# Altium project PA_PShifter_R00.PrjPcb
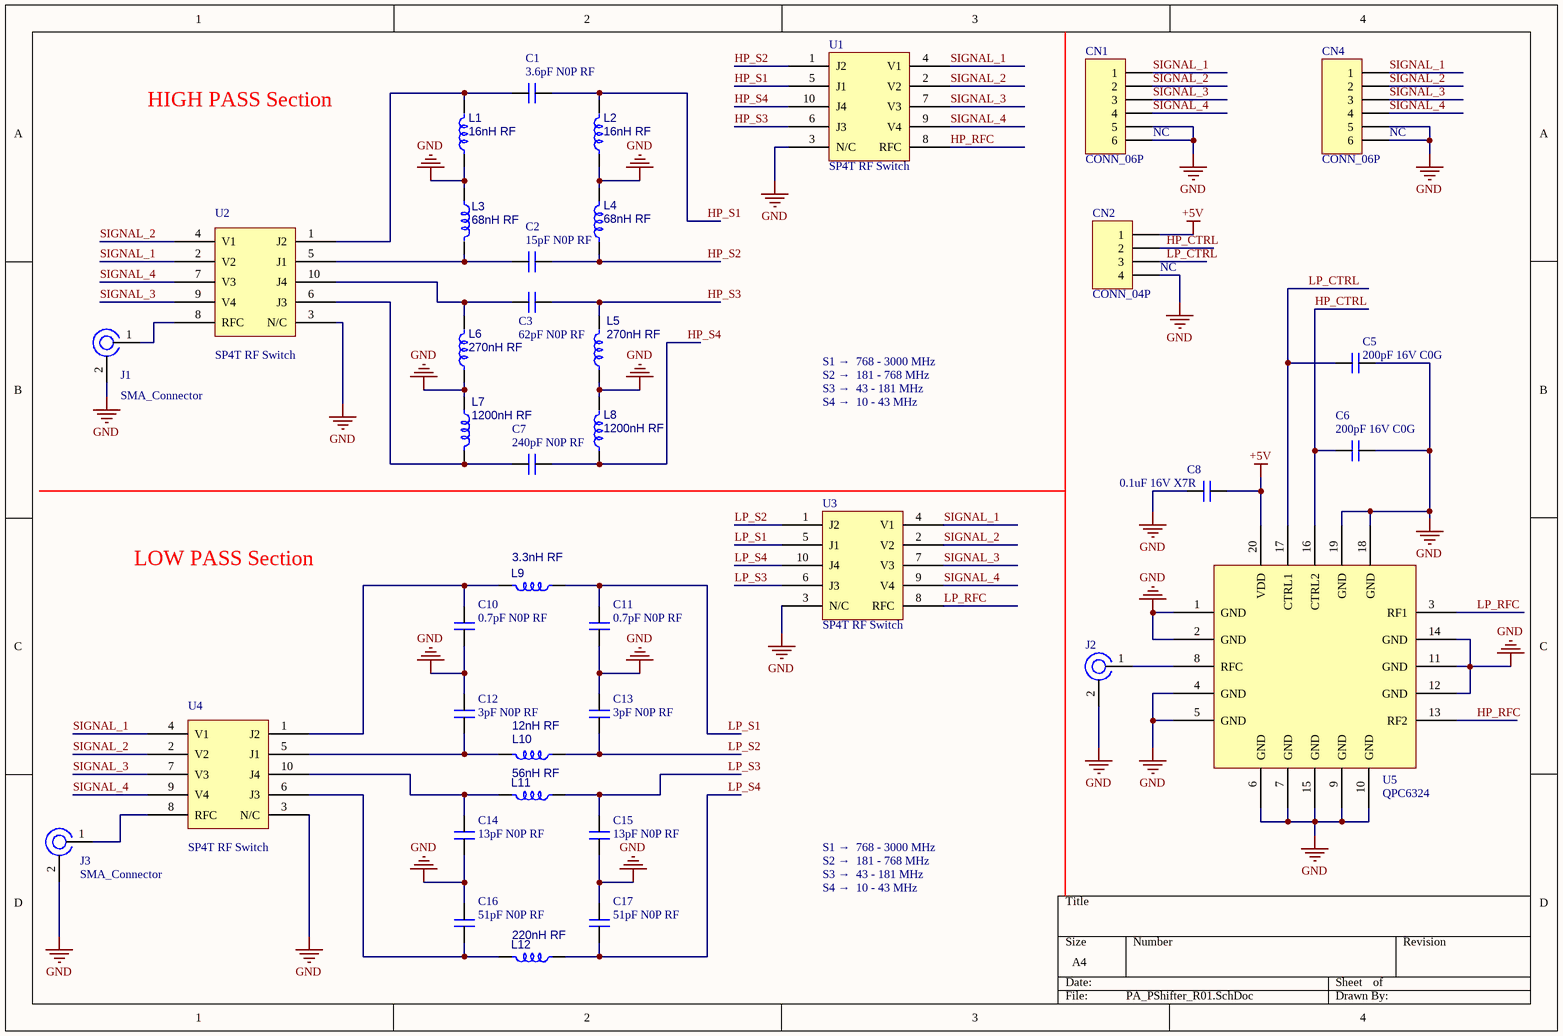
[diagram p0: PA_PShifter_R01.SchDoc]
1 sheet, 38 parts. Net scope: global (net labels, ports and power ports of the same name join across sheets).
Board file: PA_PShifter_R00.PcbDoc

## Sheet PA_PShifter_R01.SchDoc
size A4; SheetNumber: 1; SheetTotal: 1

### Parts
C1  3.6pF N0P RF  [C_0603]
C2  15pF N0P RF  [C_0603]
C3  62pF N0P RF  [C_0603]
C5  200pF 16V C0G  [C_0603]
C6  200pF 16V C0G  [C_0603]
C7  240pF N0P RF  [C_0603]
C8  0.1uF 16V X7R  [C_0603]
C10  0.7pF N0P RF  [C_0603]
C11  0.7pF N0P RF  [C_0603]
C12  3pF N0P RF  [C_0603]
C13  3pF N0P RF  [C_0603]
C14  13pF N0P RF  [C_0603]
C15  13pF N0P RF  [C_0603]
C16  51pF N0P RF  [C_0603]
C17  51pF N0P RF  [C_0603]
CN1  CONN_06P  [Header_M_2x3_0.1"]
CN2  CONN_04P  [Header_M_2x2_0.1"]
CN4  CONN_06P  [Header_M_2x3_0.1"]
J1  SMA_Connector  [SMA_Connector]
J2  SMA_Connector  [SMA_Connector]  (value not drawn)
J3  SMA_Connector  [SMA_Connector]
L1  16nH RF  [L_0603]
L2  16nH RF  [L_0603]
L3  68nH RF  [L_0603]
L4  68nH RF  [L_0603]
L5  270nH RF  [L_0603]
L6  270nH RF  [L_0603]
L7  1200nH RF  [L_0805]
L8  1200nH RF  [L_0805]
L9  3.3nH RF  [L_0603]
L10  12nH RF  [L_0603]
L11  56nH RF  [L_0603]
L12  220nH RF  [L_0603]
U1  SP4T RF Switch  [SP4T Switch RF]
U2  SP4T RF Switch  [SP4T Switch RF]
U3  SP4T RF Switch  [SP4T Switch RF]
U4  SP4T RF Switch  [SP4T Switch RF]
U5  QPC6324  [QFN50P400X400X90-21N-D]

### Nets
+5V: C8.2 CN2.1 U5.20(VDD)
GND: C5.2 C6.2 C8.1 C10.1 C11.1 C12.2 C13.2 C14.1 C15.1 C16.2 C17.2 CN1.5 CN1.6 CN2.4 CN4.5 CN4.6 J1.2 J2.2 J3.2 L1.1 L2.1 L3.1 L4.2 L5.1 L6.1 L7.1 L8.2 U1.3(N/C) U2.3(N/C) U3.3(N/C) U4.3(N/C) U5.1(GND) U5.2(GND) U5.4(GND) U5.5(GND) U5.6(GND) U5.7(GND) U5.9(GND) U5.10(GND) U5.11(GND) U5.12(GND) U5.14(GND) U5.15(GND) U5.18(GND) U5.19(GND)
HP_CTRL: C6.1 CN2.2 U5.16(CTRL2)
HP_RFC: U1.8(RFC) U5.13(RF2)
HP_S1: C1.2 L2.2 U1.5(J1)
HP_S2: C2.2 L4.1 U1.1(J2)
HP_S3: C3.2 L5.2 U1.6(J3)
HP_S4: C7.2 L8.1 U1.10(J4)
LP_CTRL: C5.1 CN2.3 U5.17(CTRL1)
LP_RFC: U3.8(RFC) U5.3(RF1)
LP_S1: C11.2 L9.1 U3.5(J1)
LP_S2: C13.1 L10.1 U3.1(J2)
LP_S3: C15.2 L11.1 U3.6(J3)
LP_S4: C17.1 L12.1 U3.10(J4)
SIGNAL_1: CN1.1 CN4.1 U1.4(V1) U2.2(V2) U3.4(V1) U4.4(V1)
SIGNAL_2: CN1.2 CN4.2 U1.2(V2) U2.4(V1) U3.2(V2) U4.2(V2)
SIGNAL_3: CN1.3 CN4.3 U1.7(V3) U2.9(V4) U3.7(V3) U4.7(V3)
SIGNAL_4: CN1.4 CN4.4 U1.9(V4) U2.7(V3) U3.9(V4) U4.9(V4)
NetC1_1: C1.1 L1.2 U2.1(J2)
NetC2_1: C2.1 L3.2 U2.5(J1)
NetC3_1: C3.1 L6.2 U2.10(J4)
NetC7_1: C7.1 L7.2 U2.6(J3)
NetC10_2: C10.2 L9.2 U4.1(J2)
NetC12_1: C12.1 L10.2 U4.5(J1)
NetC14_2: C14.2 L11.2 U4.10(J4)
NetC16_1: C16.1 L12.2 U4.6(J3)
NetJ1_1: J1.1 U2.8(RFC)
NetJ2_1: J2.1 U5.8(RFC)
NetJ3_1: J3.1 U4.8(RFC)

### Notes on the sheet
- HIGH PASS Section
- (near CN1) NC
- (near CN4) NC
- (near CN2) NC
- S1 →
- S2 →
- 181 - 768 MHz
- 768 - 3000 MHz
- S3 →
- S4 →
- 43 - 181 MHz
- 10 - 43 MHz
- LOW PASS Section

### Library data of the parts
C1-C3 C5-C8 C10-C17 = Ceramic Cap
CN1 CN4 = CONN_06P: Connector Generic 4 Vias
CN2 = CONN_04P: Connector Generic 4 Vias
J1-J3 = SMA_Connector: Connector SMA
L1-L12 = Inductor Chip: CHIP inductor
U1-U4 = SP4T RF Switch: SKY13322-375LF
U5 = QPC6324: SPDT RF Switch